# EAGLE design ArduFocuser V0.07 (EAGLE 6.3)
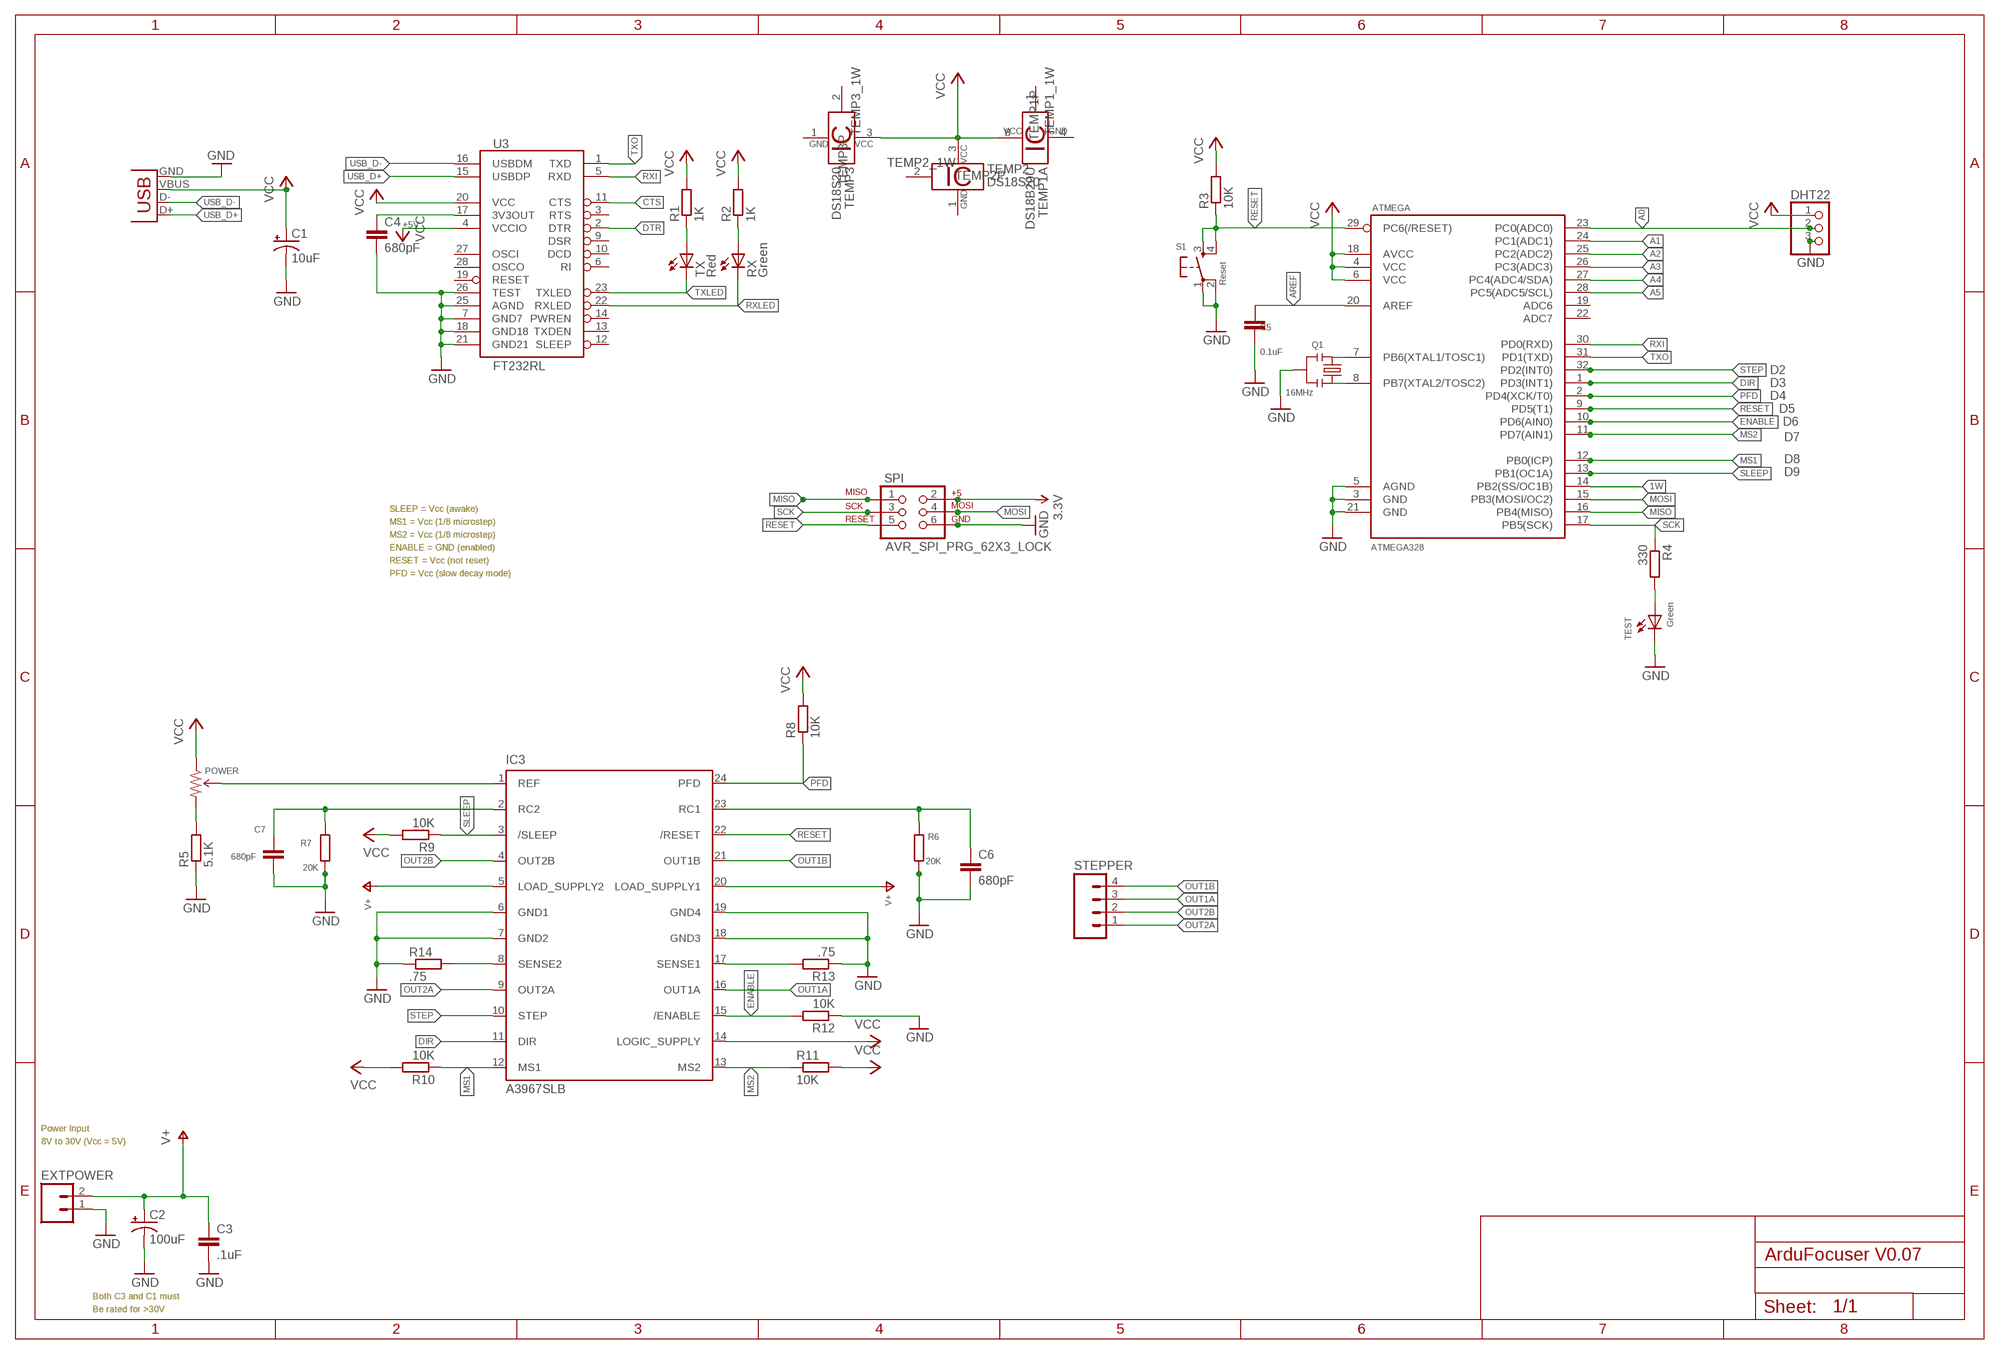
[diagram p0: schematic, sheet 1]

## Parts
ATMEGA  ATMEGA328  ATMEGA168  [TQFP32-08]
C1  10uF  CAP_POL1206  [EIA3216]
C2  100uF  CPOL-USD  [PANASONIC_D]
C3  .1uF  C-EUC0805  [C0805]
C4  680pF  C-EUC0805  [C0805]
C5  0.1uF  C-EUC0805  [C0805]
C6  680pF  C-EUC0805  [C0805]
C7  680pF  C-EUC0805  [C0805]
DHT22  PINHD-1X3  [1X03]
EXTPOWER  M02LOCK  [1X02_LOCK]
IC3  A3967SLB  [SO24W]
POWER  TRIMPOTSMD  [TRIMPOT-3MM]
Q1  16MHz  RESONATORSMD  [RESONATOR-SMD]
R1  1K  R-EU_R0805  [R0805]
R2  1K  R-EU_R0805  [R0805]
R3  10K  R-EU_R0805  [R0805]
R4  330  R-EU_R0805  [R0805]
R5  5.1K  R-EU_R0805  [R0805]
R6  20K  R-EU_R0805  [R0805]
R7  20K  R-EU_R0805  [R0805]
R8  10K  R-EU_R0805  [R0805]
R9  10K  R-EU_R0805  [R0805]
R10  10K  R-EU_R0805  [R0805]
R11  10K  R-EU_R0805  [R0805]
R12  10K  R-EU_R0805  [R0805]
R13  .75  R-EU_R0805  [R0805]
R14  .75  R-EU_R0805  [R0805]
RX  Green  LED1206  [LED-1206]
S1  Reset  TAC_SWITCHSMD  [TACTILE_SWITCH_SMD]
SPI  AVR_SPI_PRG_62X3_LOCK  [2X3_LOCK]
STEPPER  M04LOCK  [1X04_LOCK]
TEMP1  DS18B20U  [UMAX8]
TEMP2  DS18S20  [TO92-]
TEMP3  DS18S20  [TO92-]
TEST  Green  LED1206  [LED-1206]
TX  Red  LED1206  [LED-1206]
U3  FT232RL  FT232RLSSOP  [SSOP28DB]
X2  USB  USB-MICROB  [USB-MICROB]

## Nets
1W: ATMEGA.14(PB2(SS/OC1B))
3.3V: SPI.2
+5V: ATMEGA.4(VCC) ATMEGA.6(VCC) ATMEGA.18(AVCC) C1.A(+) DHT22.1 IC3.14(LOGIC_SUPPLY) POWER.1(CCW) R1.2 R2.2 R3.2 R8.2 R9.2 R10.2 R11.2 TEMP1.8 TEMP2.3 TEMP3.3 U3.4(VCCIO) U3.20(VCC) X2.VBUS ; supply symbol labelled VCC
A0: ATMEGA.23(PC0(ADC0)) DHT22.2
A1: ATMEGA.24(PC1(ADC1))
A2: ATMEGA.25(PC2(ADC2))
A3: ATMEGA.26(PC3(ADC3))
A4: ATMEGA.27(PC4(ADC4/SDA))
A5: ATMEGA.28(PC5(ADC5/SCL))
AREF: ATMEGA.20(AREF) C5.2
CTS: U3.11(CTS)
DIR: ATMEGA.1(PD3(INT1)) IC3.11(DIR)
DTR: U3.2(DTR)
ENABLE: ATMEGA.10(PD6(AIN0)) IC3.15(/ENABLE) R12.2
GND: ATMEGA.3(GND) ATMEGA.5(AGND) ATMEGA.21(GND) C1.C(-) C2.- C3.2 C4.2 C5.1 C6.2 C7.2 DHT22.3 EXTPOWER.1 IC3.6(GND1) IC3.7(GND2) IC3.18(GND3) IC3.19(GND4) Q1.2 R5.1 R6.1 R7.1 R12.1 R13.1 R14.1 S1.1 S1.2 SPI.6 TEST.C U3.7(GND7) U3.18(GND18) U3.21(GND21) U3.25(AGND) U3.26(TEST) X2.GND
MISO: ATMEGA.16(PB4(MISO)) SPI.1
MOSI: ATMEGA.15(PB3(MOSI/OC2)) SPI.4
MS1: ATMEGA.12(PB0(ICP)) IC3.12(MS1) R10.1
MS2: ATMEGA.11(PD7(AIN1)) IC3.13(MS2) R11.1
N$1: ATMEGA.8(PB7(XTAL2/TOSC2)) Q1.1
N$2: ATMEGA.7(PB6(XTAL1/TOSC1)) Q1.3
N$3: R1.1 TX.A
N$4: R2.1 RX.A
N$5: C4.1 U3.17(3V3OUT)
N$7: R4.2 TEST.A
N$8: IC3.8(SENSE2) R14.2
N$9: IC3.17(SENSE1) R13.2
N$10: C7.1 IC3.2(RC2) R7.2
N$13: C6.1 IC3.23(RC1) R6.2
N$14: IC3.1(REF) POWER.2(WIPER)
N$16: POWER.3(CW) R5.2
OUT1A [MOTOR OUT]: IC3.16(OUT1A) STEPPER.3
OUT1B [MOTOR OUT]: IC3.21(OUT1B) STEPPER.4
OUT2A [MOTOR OUT]: IC3.9(OUT2A) STEPPER.1
OUT2B [MOTOR OUT]: IC3.4(OUT2B) STEPPER.2
PFD: ATMEGA.2(PD4(XCK/T0)) IC3.24(PFD) R8.1
RESET: ATMEGA.9(PD5(T1)) ATMEGA.29(PC6(/RESET)) IC3.22(/RESET) R3.1 S1.3 S1.4 SPI.5
RXI: ATMEGA.30(PD0(RXD)) U3.5(RXD)
RXLED: RX.C U3.22(RXLED)
SCK: ATMEGA.17(PB5(SCK)) R4.1 SPI.3
SLEEP: ATMEGA.13(PB1(OC1A)) IC3.3(/SLEEP) R9.1
STEP: ATMEGA.32(PD2(INT0)) IC3.10(STEP)
TXLED: TX.C U3.23(TXLED)
TXO: ATMEGA.31(PD1(TXD)) U3.1(TXD)
USB_D+: U3.15(USBDP) X2.D+
USB_D-: U3.16(USBDM) X2.D-
V+ [power]: C2.+ C3.1 EXTPOWER.2 IC3.5(LOAD_SUPPLY2) IC3.20(LOAD_SUPPLY1)
Unconnected: ATMEGA.19(ADC6) ATMEGA.22(ADC7) U3.3(RTS) U3.6(RI) U3.9(DSR) U3.10(DCD) U3.12(SLEEP) U3.13(TXDEN) U3.14(PWREN) U3.19(RESET) U3.27(OSCI) U3.28(OSCO)

## Notes on the sheet
- D2
- D3
- D4
- D5
- D6
- D7
- D8
- D9
- SLEEP = Vcc (awake)
- MS1 = Vcc (1/8 microstep)
- MS2 = Vcc (1/8 microstep)
- ENABLE = GND (enabled)
- RESET = Vcc (not reset)
- PFD = Vcc (slow decay mode)
- Power Input
- 8V to 30V (Vcc = 5V)
- Both C3 and C1 must
- Be rated for >30V

## Power pins joined to a net without a drawn wire
1W: TEMP1.1 TEMP2.2 TEMP3.2
GND: TEMP1.4 TEMP2.1 TEMP3.1

## Library data of the parts
ATMEGA = SparkFun:ATMEGA168
C1 = SparkFun:CAP_POL: Capacitor Polarized These are standard SMD and PTH capacitors. Normally 10uF, 47uF, and 100uF in electrolytic and tantalum varieties. Always verify the external diameter of the through hole cap, it varies with capacity, voltage, and manufacturer. The EIA devices should be standard.
C2 = rcl:CPOL-US: POLARIZED CAPACITOR, American symbol
C3-C7 = rcl:C-EU: CAPACITOR, European symbol
DHT22 = adafruit:PINHD-1X3: PIN HEADER
EXTPOWER = SparkFun:M02: Header 2 Standard 2-pin 0.1" header. Use with straight break away headers (SKU : PRT-00116), right angle break away headers (PRT-00553), swiss pins (PRT-00743), machine pins (PRT-00117), and female headers (PRT-00115). Molex polarized connector foot print use with SKU : PRT-08233 with associated crimp pins and housings.
IC3 = Allegro:A3967SLB: ANALOG DEVICES
POWER = SparkFun:TRIMPOT
Q1 = SparkFun:RESONATOR: Resonator Small SMD resonator. This is the itty bitty 10/20MHz resonators with built in caps. CSTCE10M0G55 and CSTCE20M0V53. Footprint has been reviewed closely but hasn't been tested yet.
R1-R14 = rcl:R-EU_: RESISTOR, European symbol
RX TEST TX = SparkFun:LED: LEDs Standard schematic elements and footprints for 5mm, 3mm, 1206, and 0603 sized LEDs. 5mm - Spark Fun Electronics SKU : COM-00529 (and others)
S1 = SparkFun:TAC_SWITCH: Momentary Switch Button commonly used for reset or general input. Spark Fun Electronics SKU : COM-00097
SPI = SparkFun:AVR_SPI_PRG_6: AVR ISP 6 Pin This is the reduced ISP connector for AVR programming. Common on Arduino. This footprint will take up less PCB space and can be used with a 10-pin to 6-pin adapter such as SKU: BOB-08508
STEPPER = SparkFun:M04: Header 4 Standard 4-pin 0.1" header. Use with straight break away headers (SKU : PRT-00116), right angle break away headers (PRT-00553), swiss pins (PRT-00743), machine pins (PRT-00117), and female headers (PRT-00115). Molex polarized connector foot print use with SKU : PRT-08231 with associated crimp pins and housings. 1MM SMD Version SKU: PRT-10208
TEMP1 = 1wire:DS18B20: Programmable Resolution Digital Thermometer This chip provides a onewire thermosensor with approx. 0.5°C accuracy. A programmable over/undertemperure alarm is available. The precision can be set from 9..12 bits. Notes: Vdd must be applied for accurate measurements at low temperatures, as the parasite power circuit otherwise heats the sensor. If parasite power is used, Vdd has to be connected to GND. The DS1822 is a low-cost thermometer chip, the DS18S20 is similar to the DS18B20, but with 9 Bit precision only. Author: Jan Kandziora <jjj@gmx.de>
TEMP2 TEMP3 = 1wire:DS18S20: High Precision Digital Thermometer This chip provides a onewire thermosensor with approx. 0.5°C accuracy.A programmable over/undertemperure alarm is available. Notes: Vdd must be applied for accurate measurements at low temperatures, as the parasite power circuit otherwise heats the sensor. If parasite power is used, Vdd has to be connected to GND. The DS1822 is a low-cost thermometer chip, the DS18B20 is similar to the DS18S20, but with 9..12 Bit programmable precision. Author: Jan Kandziora <jjj@gmx.de>
U3 = SparkFun:FT232RL: USB UART FT232RL 4th Generation USB UART (USB <-> Serial) Controller. Spark Fun Electronics SKU : COM-00650
X2 = SparkFun:USB: USB Connectors USB-B-PTH is fully proven SKU : PRT-00139 USB-miniB is fully proven SKU : PRT-00587 USB-A-PCB is untested. USB-A-H is throughly reviewed, but untested. Spark Fun Electronics SKU : PRT-00437 USB-B-SMT is throughly reviewed, but untested. Needs silkscreen touching up. USB-A-S has not been used/tested USB-MB-H has not been used/tested

## Net classes
0 default: width 0.305 mm
1 power: width 0.762 mm
2 MOTOR OUT: width 0.381 mm

## Board
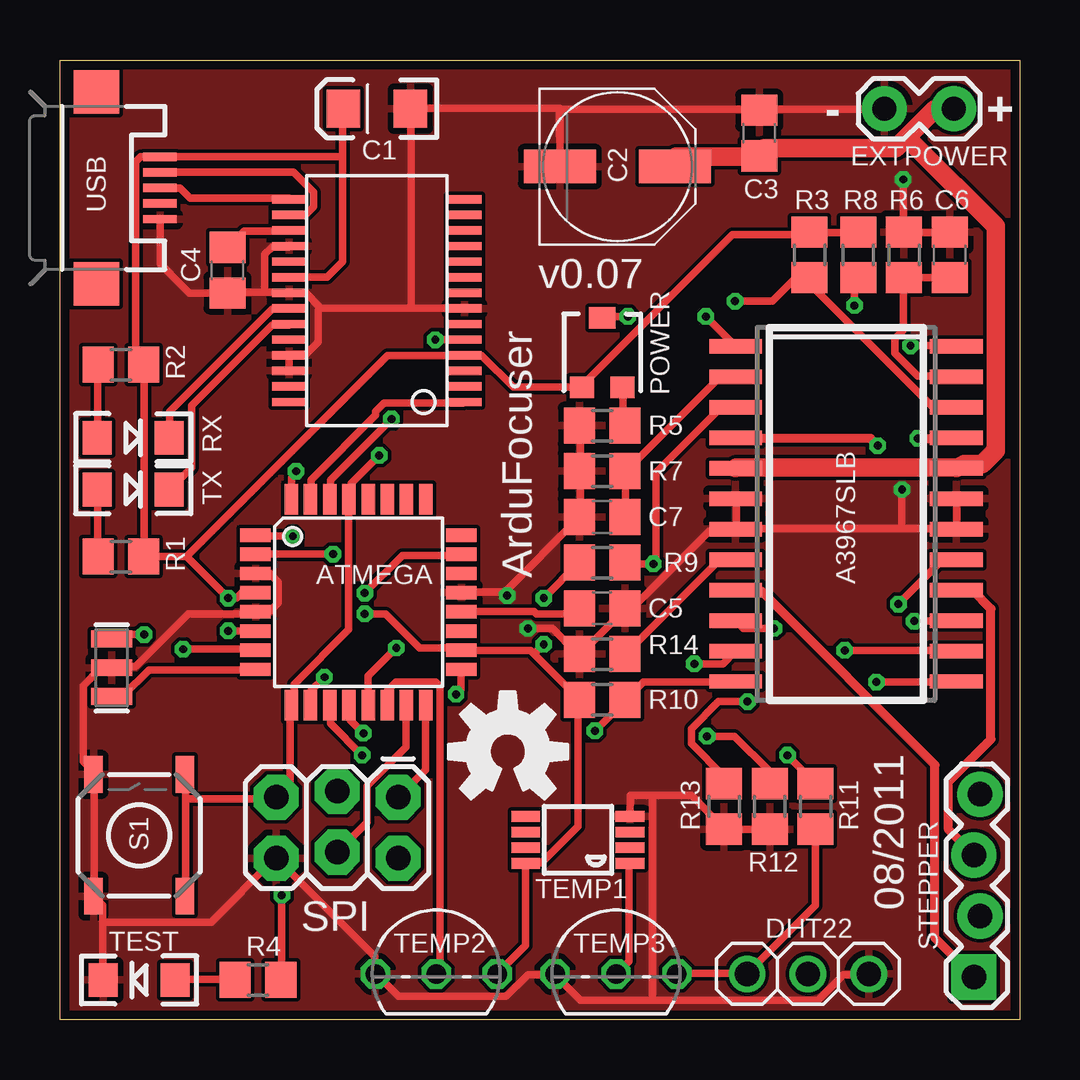
[diagram p1: board, top side]
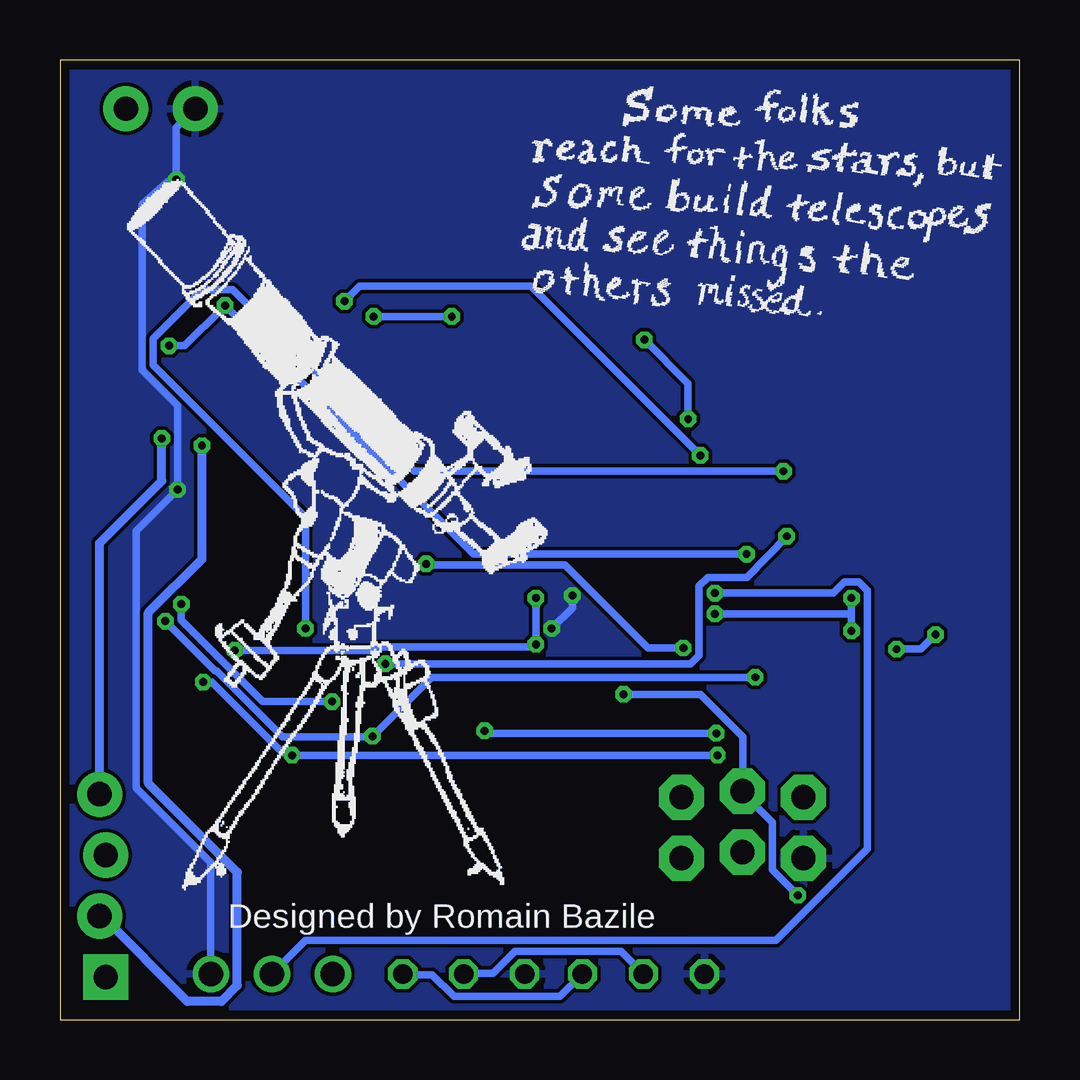
[diagram p2: board, bottom side, seen from below]

Size 40.01 x 40.01 mm. Coordinates in mm from the lower left corner, seen from the top.
Outline: 40.01,40.01 40.01,0 0,0 0,40.01 40.01,40.01
Copper layers (1*16): Top 0.0356mm / dielectric 1.5011mm / Bottom 0.0356mm
Design rules "LaenPCBOrder": minimum track width 6mil, minimum drill 13mil, track to track 6mil, track to pad 6mil, pad to pad 6mil, via to via 6mil, smd to smd 6mil, copper to edge 15mil, drill to drill 6mil, minimum pad ring 7mil, minimum via ring 7mil, stop-mask expansion 4mil, vias tented up to drill 0mil, thermal gap 10mil

### Footprints (pad centres in the part's own frame; a part is rotated, then mirrored left to right if it is on the bottom)
TQFP32-08 = smd 1.27 x 0.559: 1 -4.293,2.8; 2 -4.293,2; 3 -4.293,1.2; 4 -4.293,0.4; 5 -4.293,-0.4; 6 -4.293,-1.2; 7 -4.293,-2; 8 -4.293,-2.8; 17 4.293,-2.8; 18 4.293,-2; 19 4.293,-1.2; 20 4.293,-0.4; 21 4.293,0.4; 22 4.293,1.2; 23 4.293,2; 24 4.293,2.8 | smd 0.559 x 1.27: 9 -2.8,-4.293; 10 -2,-4.293; 11 -1.2,-4.293; 12 -0.4,-4.293; 13 0.4,-4.293; 14 1.2,-4.293; 15 2,-4.293; 16 2.8,-4.293; 25 2.8,4.293; 26 2,4.293; 27 1.2,4.293; 28 0.4,4.293; 29 -0.4,4.293; 30 -1.2,4.293; 31 -2,4.293; 32 -2.8,4.293
EIA3216 = smd 1.4 x 1.6: A 1.4,0; C -1.4,0
PANASONIC_D = smd 3 x 1.4: + 2.4,0; - -2.4,0
C0805 = smd 1.3 x 1.5: 1 -0.95,0; 2 0.95,0
1X03 = drill 1.016 round: 1 -2.54,0; 2 0,0; 3 2.54,0
1X02_LOCK = drill 1.016 pad 1.88 round: 1 -0.178,0; 2 2.718,0
SO24W = smd 0.6 x 2.2: 1 -6.985,-4.6; 2 -5.715,-4.6; 3 -4.445,-4.6; 4 -3.175,-4.6; 5 -1.905,-4.6; 6 -0.635,-4.6; 7 0.635,-4.6; 8 1.905,-4.6; 9 3.175,-4.6; 10 4.445,-4.6; 11 5.715,-4.6; 12 6.985,-4.6; 13 6.985,4.6; 14 5.715,4.6; 15 4.445,4.6; 16 3.175,4.6; 17 1.905,4.6; 18 0.635,4.6; 19 -0.635,4.6; 20 -1.905,4.6; 21 -3.175,4.6; 22 -4.445,4.6; 23 -5.715,4.6; 24 -6.985,4.6
TRIMPOT-3MM = smd 1 x 0.9: 1 -0.85,-1.45; 3 0.85,-1.45 | smd 1.1 x 0.9: 2 0,1.45
RESONATOR-SMD = smd 0.7 x 1.7: 1 -1.2,0; 2 0,0; 3 1.2,0
R0805 = smd 1.3 x 1.5: 1 -0.95,0; 2 0.95,0
LED-1206 = smd 1.2 x 1.4: A -1.5,0; C 1.5,0
TACTILE_SWITCH_SMD = smd 1.524 x 0.762: 1 -2.54,1.905; 2 2.54,1.905; 3 -2.54,-1.905; 4 2.54,-1.905
2X3_LOCK = drill 1.016 pad 1.88 octagon: 1 0,0; 2 0,2.54; 3 2.54,-0.254; 4 2.54,2.286; 5 5.08,0; 6 5.08,2.54
1X04_LOCK = drill 1.016 pad 1.88 square: 1 0,0.127 | drill 1.016 pad 1.88 round: 2 2.54,-0.127; 3 5.08,0.127; 4 7.62,-0.127
UMAX8 = smd 0.45 x 1.2: 1 -0.975,-2.175; 2 -0.325,-2.175; 3 0.325,-2.175; 4 0.975,-2.175; 5 0.975,2.175; 6 0.325,2.175; 7 -0.325,2.175; 8 -0.975,2.175
TO92- = drill 0.813 octagon: 1 -2.54,0; 2 0,0; 3 2.54,0
SSOP28DB = smd 0.348 x 1.397: 1 -4.225,-3.656; 2 -3.575,-3.656; 3 -2.925,-3.656; 4 -2.275,-3.656; 5 -1.625,-3.656; 6 -0.975,-3.656; 7 -0.325,-3.656; 8 0.325,-3.656; 9 0.975,-3.656; 10 1.625,-3.656; 11 2.275,-3.656; 12 2.925,-3.656; 13 3.575,-3.656; 14 4.225,-3.656; 15 4.225,3.656; 16 3.575,3.656; 17 2.925,3.656; 18 2.275,3.656; 19 1.625,3.656; 20 0.975,3.656; 21 0.325,3.656; 22 -0.325,3.656; 23 -0.975,3.656; 24 -1.625,3.656; 25 -2.275,3.656; 26 -2.925,3.656; 27 -3.575,3.656; 28 -4.225,3.656
USB-MICROB = smd 0.35 x 1.4: D+ 0,2.65; D- -0.65,2.65; GND 1.3,2.65; ID 0.65,2.65; VBUS -1.3,2.65 | smd 1.8 x 1.9: MT1 -4,0; MT2 4,0

### Placement (x,y rotation side)
ATMEGA  12.45,17.4 0 top
C1  13.21,37.97 180 top
C2  23.24,35.56 0 top
C3  29.15,36.96 90 top
C4  6.99,31.24 270 top
C5  22.61,17.14 180 top
C6  37.08,31.88 90 top
C7  22.61,20.95 180 top
DHT22  31.18,1.91 0 top
EXTPOWER  34.54,37.97 0 top
IC3  32.77,21.08 270 top
POWER  22.61,27.81 0 top
Q1  2.16,14.67 90 top
R1  2.54,19.3 0 top
R2  2.54,27.3 0 top
R3  31.24,31.88 90 top
R4  8.26,1.65 180 top
R5  22.61,24.77 0 top
R6  35.18,31.88 270 top
R7  22.61,22.86 0 top
R8  33.27,31.88 90 top
R9  22.61,19.05 180 top
R10  22.61,13.34 180 top
R11  31.5,8.89 270 top
R12  29.59,8.89 90 top
R13  27.69,8.89 90 top
R14  22.61,15.24 0 top
RX  3.05,24.26 0 top
S1  3.3,7.68 90 top
SPI  14.1,9.27 180 top
STEPPER  38.23,1.78 90 top
TEMP1  21.59,7.49 90 top
TEMP2  15.68,1.91 0 top
TEMP3  23.18,1.91 0 top
TEST  3.3,1.65 180 top
TX  3.05,22.1 0 top
U3  13.21,29.97 90 top
U$3  [OSHW-LOGO-M]  18.67,11.18 0 top
X2  1.52,34.67 270 top

### Tracks (layer width: path | path; a pad name or v marks a point on that pad's centre or on a via)
1W
  Top 0.305: TEMP1.1 23.72,6.48 23.72,2.44 23.22,1.93 TEMP3.2 | ATMEGA.14 13.66,13.11 13.66,13.72 14.02,14.07 15.65,14.07 15.85,13.87 15.85,2.08 15.7,1.93 TEMP2.2
  Bottom 0.305: TEMP3.2 23.16,1.93 21.95,1.93 21.03,2.85 16.61,2.85 15.7,1.93 TEMP2.2
+5V  (via drill 0.33)
  Top 0.305: R11.2 31.5,7.92 31.5,4.78 28.65,1.93 DHT22.1 28.5,1.93 25.76,1.93 TEMP3.3 | TEMP2.3 18.24,1.93 19.41,3.1 19.41,6.48 TEMP1.8 19.43,6.53 20.07,6.53 21.59,8.05 21.59,13.21 R10.2 21.64,13.36 19.76,15.24 | 19.76,15.24 19.61,15.39 16.76,15.39 ATMEGA.18 16.61,15.49 14.99,15.49 13.56,16.92 v12.7,16.92 | v20.17,17.58 21.64,19.05 R9.2 | v20.17,15.65 19.86,15.34 19.76,15.24 | v32.72,15.39 37.34,15.39 IC3.14 | R8.2 33.27,32.82 31.24,32.82 R3.2 31.14,32.72 28.04,32.72 21.79,26.47 POWER.1 21.74,26.36 18.9,26.36 17.58,27.69 16.87,27.69 U3.4 16.71,27.69 13.66,27.69 5.38,19.41 5.28,19.3 | 11.79,35.69 11.79,32.51 11.79,31.6 11.3,31.11 11.13,30.95 U3.20 | 11.79,35.69 11.79,36.12 11.79,37.95 C1.A | v7.01,16.2 8.13,16.2 ATMEGA.6 | ATMEGA.4 8.13,17.78 7.57,17.78 7.37,17.58 v7.01,17.58 6.91,17.68 5.28,19.3 | 5.28,19.3 3.5,19.3 R1.2 3.5,19.41 3.5,27.28 R2.2 3.35,27.38 3.15,27.58 3.15,35.76 3.36,35.97 X2.VBUS 11.79,35.97 11.79,35.69
  Bottom 0.305: v20.17,17.58 v20.17,15.65 20.27,15.54 26.82,15.54 26.98,15.39 v32.72,15.39 | TEMP3.3 25.7,1.88 24.49,1.88 23.57,0.96 19.15,0.96 18.24,1.88 TEMP2.3 | 7.01,16.92 v7.01,17.58 | 7.01,16.92 v7.01,16.2 | v12.7,16.92 7.11,16.92 7.01,16.92
A0  (via drill 0.33)
  Top 0.305: v12.7,17.78 14.28,19.36 16.71,19.36 ATMEGA.23
  Bottom 0.305: v12.7,17.78 7.77,17.78 7.32,18.24 6.71,18.24 6.35,17.88 6.35,7.11 10.16,3.3 29.77,3.3 31.14,1.93 DHT22.2
AREF
  Top 0.305: ATMEGA.20 16.76,17.02 19.76,17.02 19.86,16.92 21.59,16.92 21.64,16.97 21.64,17.12 C5.2
DIR  (via drill 0.33)
  Top 0.305: v26.44,14.83 27.64,14.83 28.14,15.34 IC3.11 | ATMEGA.1 8.18,20.17 9.69,20.17 v9.71,20.15
  Bottom 0.305: v9.71,20.15 11.38,18.44 13.01,18.44 13.36,18.09 13.36,15.19 13.72,14.83 v26.44,14.83
ENABLE  (via drill 0.33)
  Top 0.305: v11.02,14.28 10.46,13.72 10.46,13.11 ATMEGA.10 | R12.2 29.57,10.36 28.12,11.81 v26.98,11.81 | v35.61,16.61 37.34,16.61 IC3.15
  Bottom 0.305: v11.02,14.28 24.51,14.28 v26.98,11.81 26.98,11.79 27.84,11.79 30.73,11.79 33.48,14.53 33.53,14.53 v35.61,16.61
GND  (via drill 0.33)
  Top 0.305: ATMEGA.3 8.18,18.59 8.74,18.59 9.09,18.24 9.09,17.37 8.74,17.02 8.18,17.02 ATMEGA.5 8.03,16.92 5.33,16.92 3.15,14.73 2.29,14.73 Q1.2 2.13,14.63 1.68,14.63 0.96,13.92 0.96,10.77 1.37,10.36 S1.2 1.42,10.21 1.42,5.28 S1.1 1.42,5.13 1.78,4.78 1.78,4.06 | 1.78,4.06 1.78,1.68 TEST.C | 24.69,9.35 26.31,9.35 27.69,7.98 R13.1 27.79,7.92 29.57,7.92 R12.1 | 24.69,9.35 23.77,9.35 TEMP1.4 | 24.69,0.81 21.69,0.81 20.73,1.78 TEMP3.1 20.62,1.88 19.51,1.88 18.59,0.96 14.12,0.96 13.26,1.83 TEMP2.1 13.11,1.93 13.11,2.64 9.04,6.71 SPI.6 8.89,6.66 6.3,4.06 1.88,4.06 1.78,4.06 | 24.69,0.81 31.6,0.81 32.66,1.88 33.68,1.88 DHT22.3 | 24.69,9.35 24.69,9.25 24.69,0.91 24.69,0.81 | 18.54,17.83 16.76,17.83 ATMEGA.21 | 18.54,17.83 21.64,20.93 C7.2 21.69,21.08 21.69,22.86 R7.1 21.69,22.96 21.69,24.74 R5.1 | IC3.19 37.39,21.69 37.39,20.47 IC3.18 37.24,20.47 35.1,20.47 | IC3.7 28.19,20.47 28.19,21.69 IC3.6 | IC3.7 28.04,20.37 27.08,20.37 23.82,17.12 23.72,17.12 C5.1 23.57,17.12 21.69,15.24 R14.1 21.54,15.29 20.52,16.31 v19.51,16.31 | 35.1,20.47 28.35,20.47 IC3.7 | v18.64,17.68 18.64,17.73 18.54,17.83 | C6.2 37.08,32.82 35.2,32.82 R6.1 35.15,32.97 v35.15,35.03 | EXTPOWER.1 34.34,37.95 29.16,37.95 C3.2 29.01,37.95 20.85,37.95 C2.- 20.83,38 14.78,38 C1.C 14.63,37.95 14.63,29.77 14.63,29.67 | U3.26 9.55,27.08 9.55,27.69 U3.25 9.7,27.74 10.26,27.74 10.77,28.25 10.77,29.57 10.87,29.67 | 8.53,30.33 7.01,30.33 C4.2 | 8.53,30.33 9.55,30.33 U3.21 9.7,30.28 10.26,30.28 10.87,29.67 | U3.18 9.55,32.21 8.84,32.21 8.53,31.9 8.53,30.43 8.53,30.33 | 14.63,29.67 10.87,29.67 | 14.63,29.67 16.82,29.67 U3.7
  Top 0.305: C4.2 6.91,30.43 | v35.1,22.1 35.1,20.57 35.1,20.47 | X2.GND 4.17,31.51 5.08,30.61 5.39,30.29 C4.2
  Bottom 0.305: v18.64,17.68 18.64,17.17 v19.51,16.31 | EXTPOWER.1 34.39,37.95 35.15,37.19 v35.15,35.03 35.51,34.92 36.58,33.98 36.58,27.08 35.1,25.6 v35.1,22.1 35.2,22 36.83,20.37 36.83,9.65 33.73,6.55 33.73,1.93 DHT22.3
  pour Top: 0,-0.64 41.91,-0.64 41.91,40.64 0,40.64
  pour Bottom: 0,-0.64 41.27,-0.64 41.27,40.07 0,40.07
MISO
  Top 0.305: ATMEGA.16 15.24,10.41 14.12,9.3 SPI.1
MOSI
  Top 0.305: ATMEGA.15 14.43,13.11 14.43,11.38 12.8,9.75 12.8,8.23 11.58,7.01 SPI.4
MS1  (via drill 0.33)
  Top 0.305: v12.65,11.94 12.09,12.5 12.09,13.11 ATMEGA.12 | v22.3,12.04 23.57,13.31 R10.1 23.67,13.41 24.33,14.07 28.14,14.07 IC3.12
  Bottom 0.305: v12.65,11.94 22.2,11.94 v22.3,12.04
MS2  (via drill 0.33)
  Top 0.305: v12.6,11.02 11.28,12.34 11.28,13.11 ATMEGA.11 | v30.33,11.02 31.5,9.86 R11.1 | v34.04,14.07 37.34,14.07 IC3.13
  Bottom 0.305: v12.6,11.02 v30.33,11.02 30.43,11.12 30.73,11.12 33.68,14.07 v34.04,14.07
N$1
  Top 0.305: ATMEGA.8 8.13,14.58 3.71,14.58 2.64,13.51 2.18,13.51 Q1.1
N$2  (via drill 0.33)
  Top 0.305: v5.13,15.44 8.13,15.44 ATMEGA.7 | v3.5,16.05 2.34,16.05 2.18,15.9 Q1.3
  Bottom 0.305: v5.13,15.44 4.12,15.44 v3.5,16.05
N$3
  Top 0.305: TX.A 1.57,22.1 1.57,19.3 R1.1
N$4
  Top 0.305: RX.A 1.57,24.28 1.57,27.28 R2.1
N$5
  Top 0.305: U3.17 9.55,32.87 7.67,32.87 7.01,32.21 C4.1
N$7
  Top 0.305: TEST.A 4.83,1.68 7.26,1.68 R4.2
N$8
  Top 0.305: R14.2 23.57,15.24 27.48,19.15 28.14,19.15 IC3.8
N$9  (via drill 0.33)
  Top 0.305: v34.95,17.32 36.78,19.15 37.34,19.15 IC3.17 | 27.69,9.86 R13.2 27.69,10.13 26.31,11.51 26.31,12.12 27.46,13.26 v28.66,13.26
  Bottom 0.305: v28.66,13.26 31.55,13.26 34.95,16.66 v34.95,17.32
N$10
  Top 0.305: C7.1 23.57,20.98 23.57,22.86 R7.2 23.67,22.96 27.48,26.77 28.14,26.77 IC3.2
N$13
  Top 0.305: C6.1 35.2,30.94 R6.2 35.15,30.79 35.15,28.75 34.8,28.4 34.8,27.79 35.76,26.82 37.34,26.82 IC3.23
N$14  (via drill 0.33)
  Top 0.305: v23.67,29.31 22.61,29.31 POWER.2 | v26.92,29.31 28.14,28.09 IC3.1
  Bottom 0.305: v23.67,29.31 v26.92,29.31
N$16
  Top 0.305: POWER.3 23.47,26.31 23.47,24.84 23.52,24.79 R5.2
OUT1A
  Top 0.381: STEPPER.3 37.03,7.92 37.03,9.91 38.81,11.68 38.81,17.12 38.05,17.88 37.39,17.88 IC3.16
OUT1B  (via drill 0.33)
  Top 0.381: v35.76,24.23 37.34,24.23 IC3.21
  Bottom 0.381: v35.76,24.23 35.76,22.45 38.35,19.86 STEPPER.4
OUT2A
  Top 0.381: STEPPER.1 36.47,3.4 36.47,10.62 29.21,17.88 28.19,17.88 IC3.9
OUT2B  (via drill 0.33)
  Top 0.381: v34.09,23.93 33.78,24.23 28.19,24.23 IC3.4
  Bottom 0.381: v34.09,23.93 34.09,19.2 36.32,16.97 36.32,9.86 32.61,6.15 32.61,1.42 33.27,0.76 34.7,0.76 38.25,4.32 STEPPER.2
PFD  (via drill 0.33)
  Top 0.305: v11.38,19.41 8.18,19.41 ATMEGA.2 | v33.12,29.77 33.12,30.73 33.27,30.89 R8.1 | v35.46,28.09 37.34,28.09 IC3.24
  Bottom 0.305: v11.38,19.41 22.76,19.41 v33.12,29.77 33.22,29.67 34.8,28.09 v35.46,28.09
RESET  (via drill 0.33)
  Top 0.305: IC3.22 37.34,25.55 36.37,25.55 31.24,30.68 31.24,30.89 R3.1 31.14,30.96 30.61,30.86 29.69,29.95 v28.14,29.95 | 5.23,9.2 5.23,10.21 S1.4 | 5.23,9.2 5.23,5.18 S1.3 | 5.23,9.2 5.33,9.2 8.89,9.2 SPI.5 9.04,9.3 9.6,9.86 9.6,13.11 ATMEGA.9 9.75,13.21 9.75,13.97 12.04,16.26 ATMEGA.29 12.14,21.79 12.14,22.35 v13.31,23.52
  Bottom 0.305: v13.31,23.52 20.37,30.58 27.51,30.58 v28.14,29.95
RXI  (via drill 0.33)
  Top 0.305: v13.82,25.04 11.28,22.5 11.28,21.69 ATMEGA.30 | v15.65,28.35 16.82,28.35 U3.5
  Bottom 0.305: v13.82,25.04 13.82,26.52 v15.65,28.35
RXLED
  Top 0.305: U3.22 9.55,29.62 8.84,29.62 4.57,25.35 4.57,24.28 RX.C
SCK  (via drill 0.33)
  Top 0.305: v16.51,13.56 16.71,13.77 16.71,14.58 ATMEGA.17 | v9.25,5.18 9.25,1.68 R4.1
  Bottom 0.305: v16.51,13.56 13.31,13.56 11.53,11.79 11.53,9.55 SPI.3 11.48,9.4 10.31,8.23 10.31,6.25 v9.25,5.18
SLEEP  (via drill 0.33)
  Top 0.305: v14.02,15.49 12.85,14.33 ATMEGA.13 | R9.1 23.57,19.05 23.62,19 v24.74,19 24.84,19.1 24.84,22.81 27.53,25.5 28.14,25.5 IC3.3
  Bottom 0.305: v14.02,15.49 15.49,15.49 18.95,18.95 24.69,18.95 v24.74,19
STEP  (via drill 0.33)
  Top 0.305: v9.84,22.86 9.65,22.61 ATMEGA.32 | v29.77,16.31 28.5,16.31 28.19,16.61 IC3.10
  Bottom 0.305: v9.84,22.86 25.25,22.86 32.82,30.43 34.09,30.43 36.12,28.4 36.12,27.28 29.77,20.93 v29.77,16.31
TXLED
  Top 0.305: U3.23 9.55,28.96 8.84,28.96 5.49,25.6 5.49,23.01 4.57,22.1 TX.C
TXO
  Top 0.305: ATMEGA.31 10.46,21.69 10.46,22.5 13.16,25.2 13.16,25.35 13.51,25.7 16.82,25.7 U3.1
USB_D+
  Top 0.305: U3.15 9.55,34.24 5.44,34.24 5,34.67 X2.D+
USB_D-
  Top 0.305: U3.16 9.6,33.58 10.26,33.58 10.57,33.88 10.57,34.49 9.74,35.32 X2.D-
V+
  Top 0.762: IC3.5 28.19,23.01 37.34,23.01 IC3.20 37.69,23.16 38.46,23.16 39.01,23.72 39.01,33.07 35.56,36.52 35.31,36.78 | C2.+ 25.68,35.97 25.81,35.97 29.11,35.97 C3.1 29.36,36.32 34.85,36.32 35.31,36.78 | 35.31,36.78 36.47,37.95 37.24,37.95 EXTPOWER.2

### Text on the board
tNames: - | + | v0.07 | ArduFocuser | 08/2011
bNames: Designed by Romain Bazile